# Altium schematic sheet TXRobot-Boutons.SchDoc
size A4; PageSetup: Record=PageOptions|CenterHorizontal=True|CenterVertical=True|PrintScale=1.00|XCorrection=1.00|YCorrection=1.00|PrintKind=1|BorderSize=5000000|LeftOffset=0|BottomOffset=0|Orientation=2|PaperLength=2970|PaperWidth=2100|Scale=100|PaperSource=7|PrintQuality=1200|MediaType=1|DitherType=10|PaperKind=A4|PrintScaleMode=1
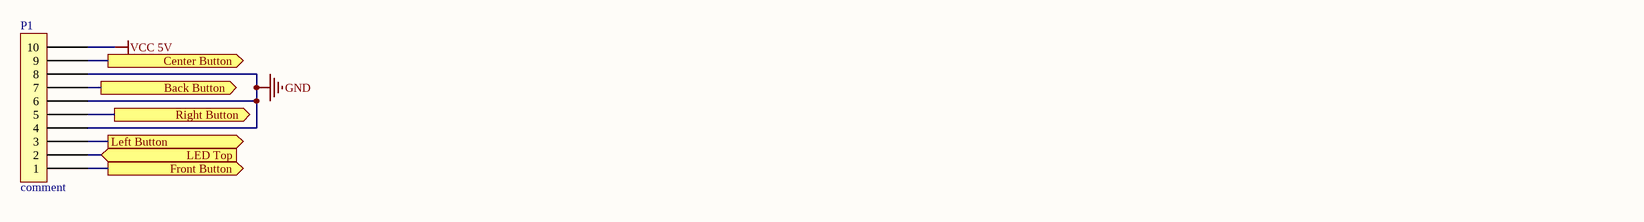
[diagram p0: TXRobot-Boutons.SchDoc]

## Parts
P1  comment  [HE10-10V]

## Ports
Back Button (out), Center Button (out), Front Button (out), LED Top (in), Left Button (out), Right Button (out)

## Nets
GND: P1.4 P1.6 P1.8
VCC 5V: P1.10
Back Button: P1.7 ; port Back Button
Center Button: P1.9 ; port Center Button
Front Button: P1.1 ; port Front Button
LED Top: P1.2 ; port LED Top
Left Button: P1.3 ; port Left Button
Right Button: P1.5 ; port Right Button

## Notes on the sheet
- (near P1) Connecteur carte bouton

## Library data of the parts
P1 = HE10-10: 10-pin connector